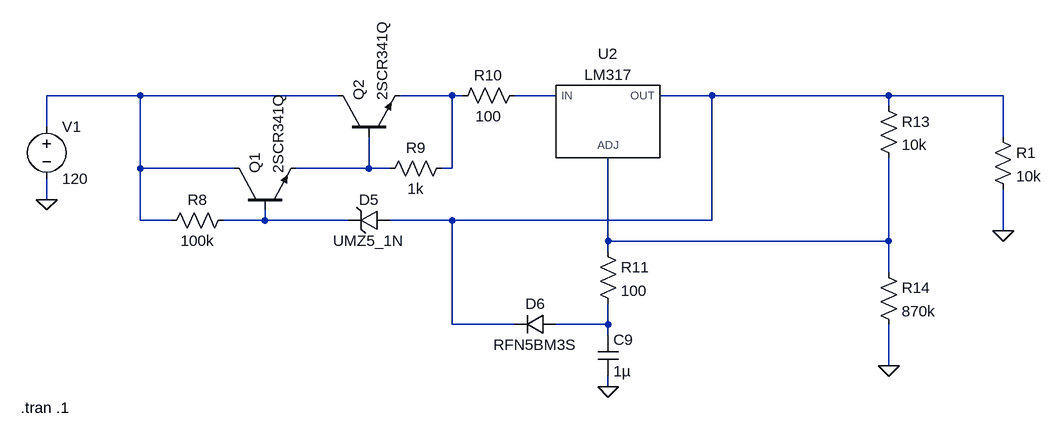
[diagram p0: schematic LM317_HV_Positive.asc]
LM317_HV_Positive.asc, the LTspice schematic file:
Version 4
SHEET 1 2244 680
WIRE 848 -656 704 -656
WIRE 1152 -656 848 -656
WIRE 1328 -656 1248 -656
WIRE 1344 -656 1328 -656
WIRE 1488 -656 1424 -656
WIRE 1728 -656 1648 -656
WIRE 2000 -656 1728 -656
WIRE 2176 -656 2000 -656
WIRE 2000 -640 2000 -656
WIRE 704 -608 704 -656
WIRE 2176 -592 2176 -656
WIRE 848 -544 848 -656
WIRE 992 -544 848 -544
WIRE 1200 -544 1200 -592
WIRE 1200 -544 1088 -544
WIRE 1232 -544 1200 -544
WIRE 1328 -544 1328 -656
WIRE 1328 -544 1312 -544
WIRE 704 -496 704 -528
WIRE 848 -464 848 -544
WIRE 896 -464 848 -464
WIRE 1040 -464 1040 -480
WIRE 1040 -464 976 -464
WIRE 1168 -464 1040 -464
WIRE 1328 -464 1232 -464
WIRE 1728 -464 1728 -656
WIRE 1728 -464 1328 -464
WIRE 2176 -448 2176 -512
WIRE 1568 -432 1568 -560
WIRE 2000 -432 2000 -560
WIRE 2000 -432 1568 -432
WIRE 1568 -416 1568 -432
WIRE 2000 -384 2000 -432
WIRE 1328 -304 1328 -464
WIRE 1424 -304 1328 -304
WIRE 1568 -304 1568 -336
WIRE 1568 -304 1488 -304
WIRE 1568 -288 1568 -304
WIRE 2000 -240 2000 -304
WIRE 1568 -208 1568 -224
FLAG 1568 -208 0
FLAG 2000 -240 0
FLAG 704 -496 0
FLAG 2176 -448 0
SYMBOL npn 992 -480 R270
SYMATTR InstName Q1
SYMATTR Value 2SCR341Q
SYMBOL npn 1152 -592 R270
SYMATTR InstName Q2
SYMATTR Value 2SCR341Q
SYMBOL res 992 -480 R90
WINDOW 0 0 56 VBottom 2
WINDOW 3 32 56 VTop 2
SYMATTR InstName R8
SYMATTR Value 100k
SYMATTR SpiceLine tol=1 pwr=.5
SYMBOL res 1328 -560 R90
WINDOW 0 0 56 VBottom 2
WINDOW 3 32 56 VTop 2
SYMATTR InstName R9
SYMATTR Value 1k
SYMATTR SpiceLine tol=1 pwr=.5
SYMBOL res 1440 -672 R90
WINDOW 0 0 56 VBottom 2
WINDOW 3 32 56 VTop 2
SYMATTR InstName R10
SYMATTR Value 100
SYMATTR SpiceLine tol=1 pwr=2
SYMBOL zener 1232 -480 R90
WINDOW 0 0 32 VBottom 2
WINDOW 3 32 32 VTop 2
SYMATTR InstName D5
SYMATTR Value UMZ5_1N
SYMATTR Description Diode
SYMATTR Type diode
SYMBOL LM317 1568 -624 R0
SYMATTR InstName U2
SYMBOL res 1552 -432 R0
SYMATTR InstName R11
SYMATTR Value 100
SYMATTR SpiceLine tol=1 pwr=1
SYMBOL diode 1488 -320 R90
WINDOW 0 0 32 VBottom 2
WINDOW 3 32 32 VTop 2
SYMATTR InstName D6
SYMATTR Value RFN5BM3S
SYMBOL cap 1552 -288 R0
SYMATTR InstName C9
SYMATTR Value 1µ
SYMBOL res 1984 -656 R0
SYMATTR InstName R13
SYMATTR Value 10k
SYMATTR SpiceLine tol=1 pwr=.5
SYMBOL res 1984 -400 R0
SYMATTR InstName R14
SYMATTR Value 870k
SYMATTR SpiceLine tol=1 pwr=5
SYMBOL voltage 704 -624 R0
WINDOW 123 0 0 Left 0
WINDOW 39 0 0 Left 0
SYMATTR InstName V1
SYMATTR Value 120
SYMBOL res 2160 -608 R0
SYMATTR InstName R1
SYMATTR Value 10k
TEXT 664 -176 Left 2 !.tran .1

The netlist it stands for:
* LM317_HV_Positive.asc
Q1 N001 N006 N005 0 2SCR341Q
Q2 N001 N005 N002 0 2SCR341Q
R8 N006 N001 100k tol=1 pwr=.5
R9 N002 N005 1k tol=1 pwr=.5
R10 N003 N002 100 tol=1 pwr=2
D5 N004 N006 UMZ5_1N
XU2 N003 N007 N004 LM317  ; pins IN ADJ OUT
R11 N007 N008 100 tol=1 pwr=1
D6 N008 N004 RFN5BM3S
C9 N008 0 1µ
R13 N004 N007 10k tol=1 pwr=.5
R14 N007 0 870k tol=1 pwr=5
V1 N001 0 120
R1 N004 0 10k
.model D D
.lib standard.dio
.model NPN NPN
.model PNP PNP
.lib standard.bjt
.tran .1
.lib LM317.sub
.backanno
.end